# Altium schematic sheet WEB_SERVER.SchDoc: *MC100VER9(webserver)
size A2; Revision: 1
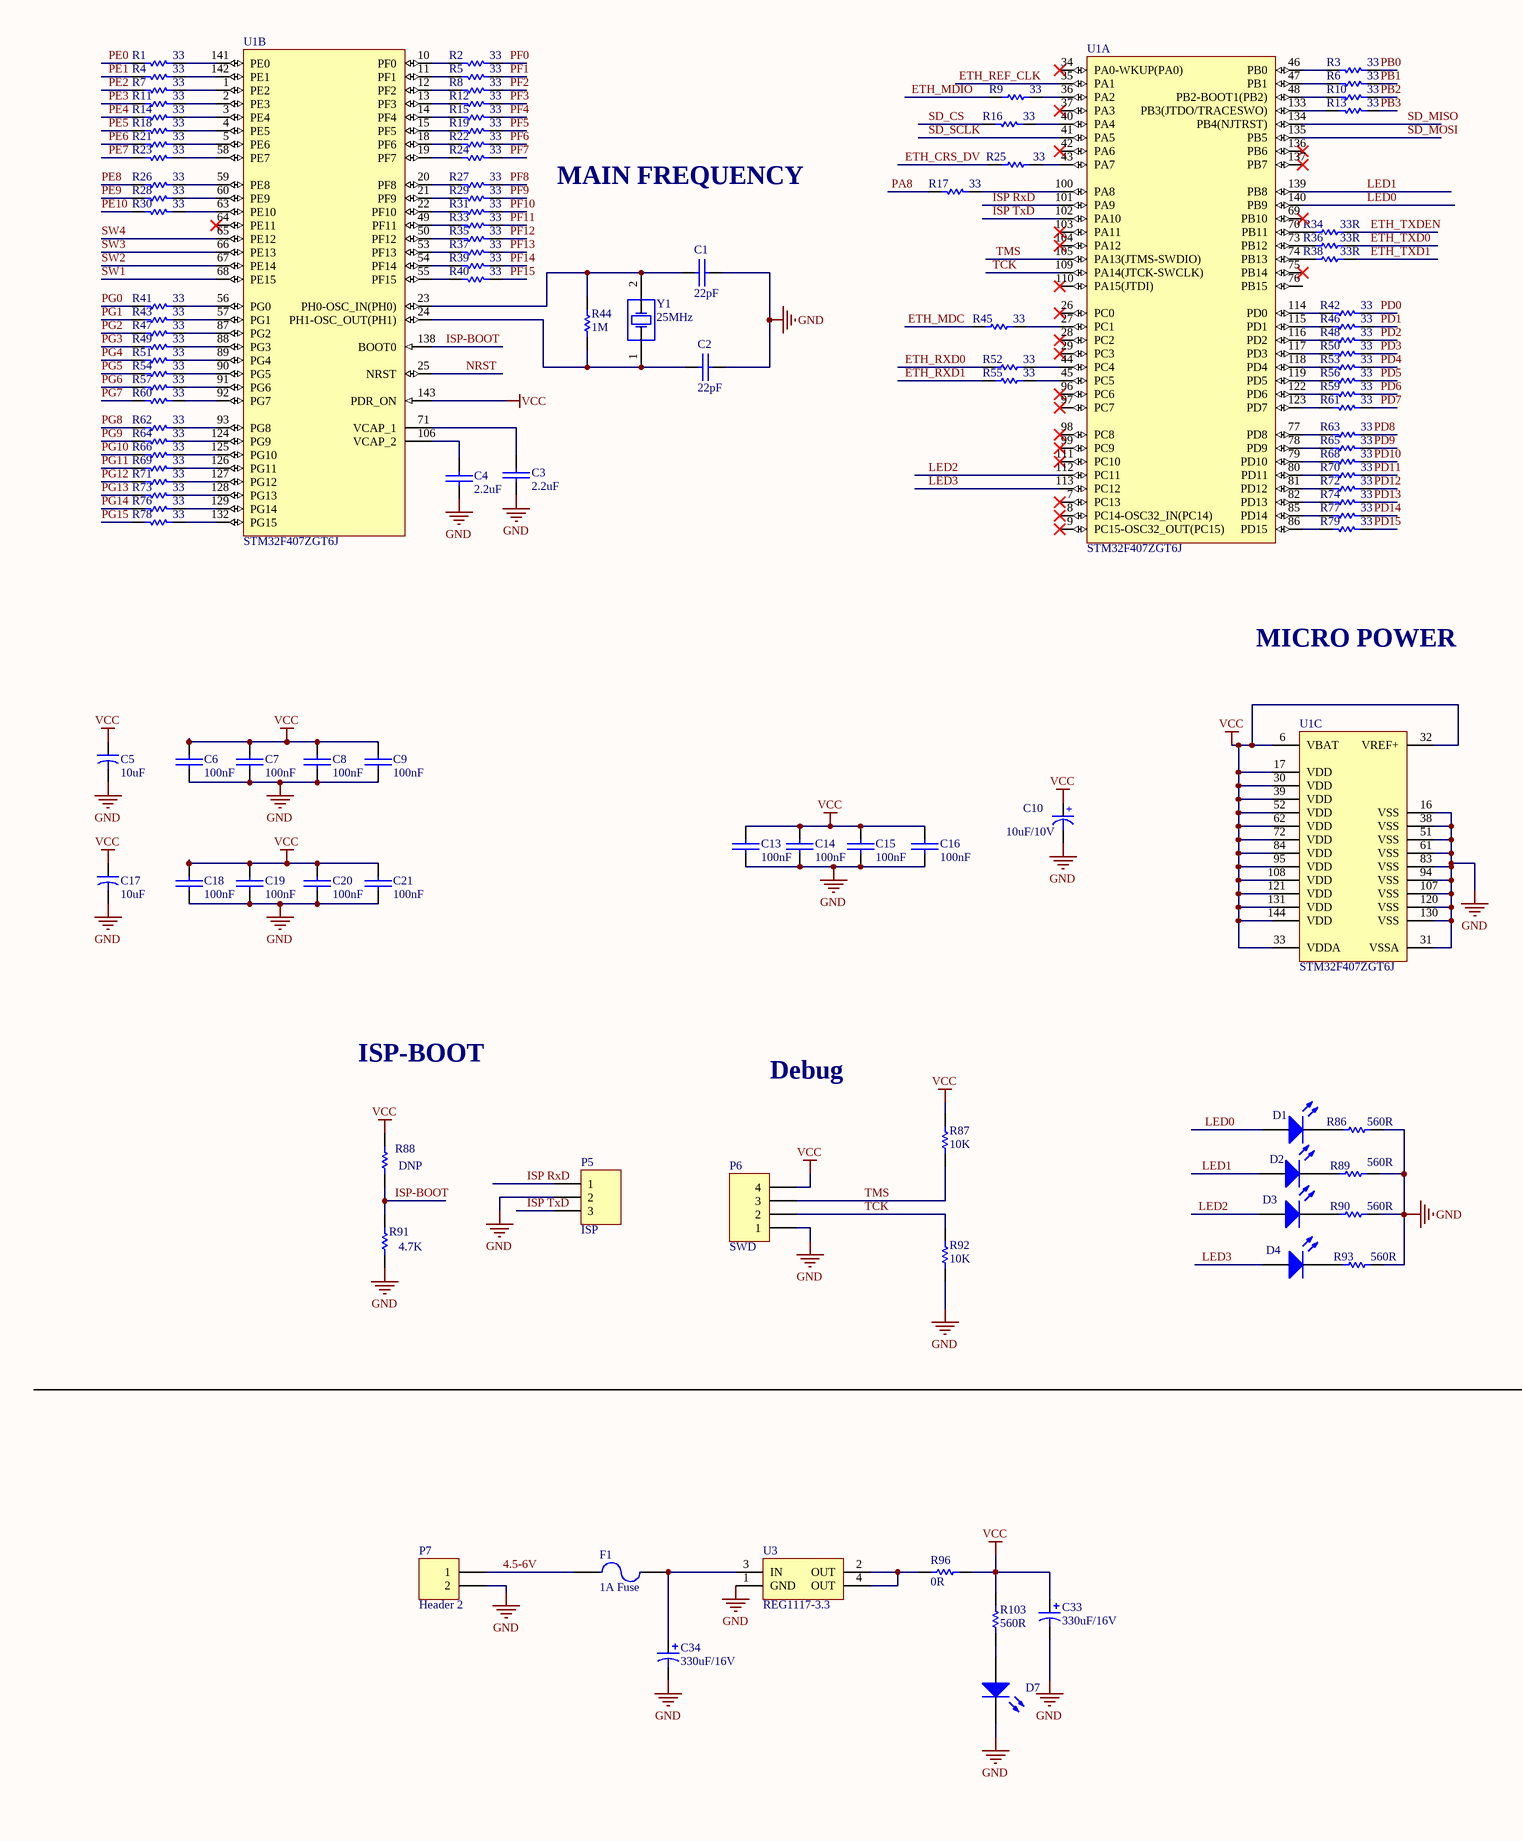
[diagram p0: WEB_SERVER.SchDoc, left]
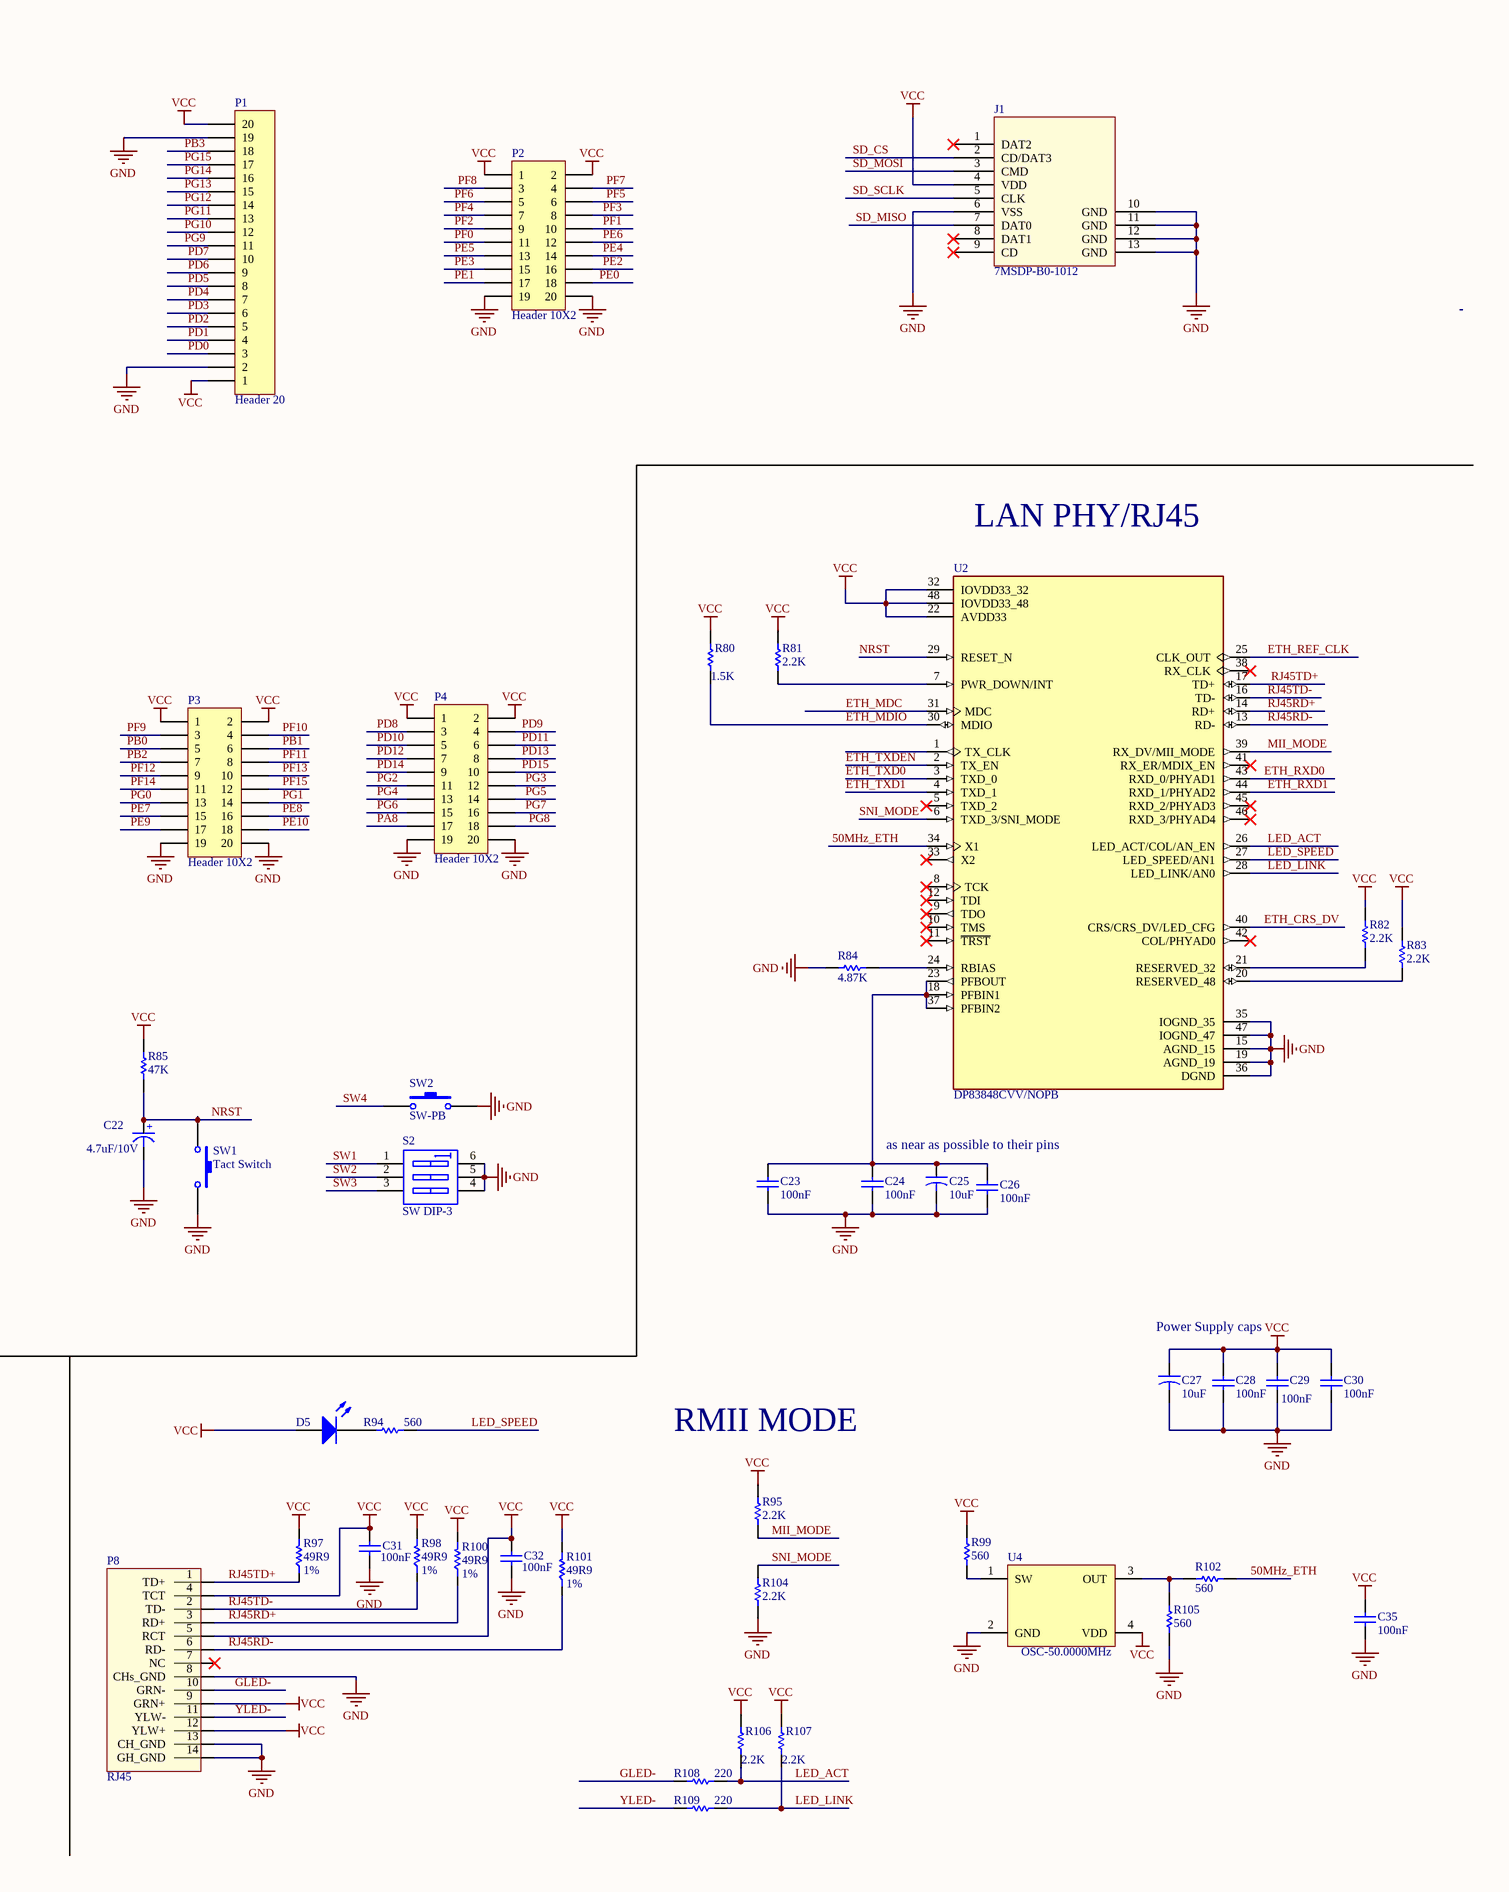
[diagram p1: WEB_SERVER.SchDoc, right]

## Parts
C1  22pF  [C0805]
C2  22pF  [C0805]
C3  2.2uF  [C0805]
C4  2.2uF  [C0805]
C5  10uF  [CAP_Tantal_1206]
C6  100nF  [C0805]
C7  100nF  [C0805]
C8  100nF  [C0805]
C9  100nF  [C0805]
C10  10uF/10V  [CAP_Tantal_1206]
C13  100nF  [C0805]
C14  100nF  [C0805]
C15  100nF  [C0805]
C16  100nF  [C0805]
C17  10uF  [CAP_Tantal_1206]
C18  100nF  [C0805]
C19  100nF  [C0805]
C20  100nF  [C0805]
C21  100nF  [C0805]
C22  4.7uF/10V  [Tantalium CAPP Size A 1206 (3216X18L)]
C23  100nF  [c0805]
C24  100nF  [c0805]
C25  10uF  [CAP_Tantal_1206]
C26  100nF  [c0805]
C27  10uF  [CAP_Tantal_1206]
C28  100nF  [c0805]
C29  100nF  [c0805]
C30  100nF  [c0805]
C31  100nF  [c0805]
C32  100nF  [c0805]
C33  330uF/16V  [RB.15/.3]
C34  330uF/16V  [RB.15/.3]
C35  100nF  [c0805]
D1  LED1  [LED_805]  (value not drawn)
D2  LED1  [LED_805]  (value not drawn)
D3  LED2  [LED_805]  (value not drawn)
D4  LED3  [LED_805]  (value not drawn)
D5  SPEED(G)  [LED0805]  (value not drawn)
D7  LED G  [LED_805]  (value not drawn)
F1  1A Fuse  [6-0805_L]
J1  7MSDP-B0-1012  [MicroSD Slot]
P1  Header 20  [HDR1X20]
P2  Header 10X2  [HDR2X10]
P3  Header 10X2  [HDR2X10]
P4  Header 10X2  [HDR2X10]
P5  ISP  [HDR1X3]
P6  SWD  [HDR1X4]
P7  Header 2  [HDR1X2]
P8  RJ45  [RJ245]
R1  33  [6-0805_L]
R2  33  [6-0805_L]
R3  33  [6-0805_L]
R4  33  [6-0805_L]
R5  33  [6-0805_L]
R6  33  [6-0805_L]
R7  33  [6-0805_L]
R8  33  [6-0805_L]
R9  33  [c0805]
R10  33  [6-0805_L]
R11  33  [6-0805_L]
R12  33  [6-0805_L]
R13  33  [6-0805_L]
R14  33  [6-0805_L]
R15  33  [6-0805_L]
R16  33  [6-0805_L]
R17  33  [6-0805_L]
R18  33  [6-0805_L]
R19  33  [6-0805_L]
R21  33  [6-0805_L]
R22  33  [6-0805_L]
R23  33  [6-0805_L]
R24  33  [6-0805_L]
R25  33  [c0805]
R26  33  [6-0805_L]
R27  33  [6-0805_L]
R28  33  [6-0805_L]
R29  33  [6-0805_L]
R30  33  [6-0805_L]
R31  33  [6-0805_L]
R33  33  [6-0805_L]
R34  33R  [6-0805_L]
R35  33  [6-0805_L]
R36  33R  [6-0805_L]
R37  33  [6-0805_L]
R38  33R  [6-0805_L]
R39  33  [6-0805_L]
R40  33  [6-0805_L]
R41  33  [6-0805_L]
R42  33  [6-0805_L]
R43  33  [6-0805_L]
R44  1M  [c0805]
R45  33  [c0805]
R46  33  [6-0805_L]
R47  33  [6-0805_L]
R48  33  [6-0805_L]
R49  33  [6-0805_L]
R50  33  [6-0805_L]
R51  33  [6-0805_L]
R52  33  [c0805]
R53  33  [6-0805_L]
R54  33  [6-0805_L]
R55  33  [c0805]
R56  33  [6-0805_L]
R57  33  [6-0805_L]
R59  33  [6-0805_L]
R60  33  [6-0805_L]
R61  33  [6-0805_L]
R62  33  [6-0805_L]
R63  33  [6-0805_L]
R64  33  [6-0805_L]
R65  33  [6-0805_L]
R66  33  [6-0805_L]
R68  33  [6-0805_L]
R69  33  [6-0805_L]
R70  33  [6-0805_L]
R71  33  [6-0805_L]
R72  33  [6-0805_L]
R73  33  [6-0805_L]
R74  33  [6-0805_L]
R76  33  [6-0805_L]
R77  33  [6-0805_L]
R78  33  [6-0805_L]
R79  33  [6-0805_L]
R80  1.5K  [c0805]
R81  2.2K  [c0805]
R82  2.2K  [c0805]
R83  2.2K  [c0805]
R84  4.87K  [c0805]
R85  47K  [6-0805_L]
R86  560R  [6-0805_L]
R87  10K  [6-0805_L]
R88  DNP  [6-0805_L]
R89  560R  [6-0805_L]
R90  560R  [6-0805_L]
R91  4.7K  [6-0805_L]
R92  10K  [6-0805_L]
R93  560R  [6-0805_L]
R94  560  [c0805]
R95  2.2K  [c0805]
R96  0R  [6-0805_L]
R97  Tolerance: 1%  [c0805]  (hidden comment: 49R9)
R98  Tolerance: 1%  [c0805]  (hidden comment: 49R9)
R99  560  [c0805]
R100  Tolerance: 1%  [c0805]  (hidden comment: 49R9)
R101  Tolerance: 1%  [c0805]  (hidden comment: 49R9)
R102  560  [c0805]
R103  560R  [6-0805_L]
R104  2.2K  [c0805]
R105  560  [c0805]
R106  2.2K  [c0805]
R107  2.2K  [c0805]
R108  220  [c0805]
R109  220  [c0805]
S2  SW DIP-3  [DIP-6]
SW1  Tact Switch  [TUCHSWITCH_SMD_2]
SW2  SW-PB  [TUCHSWITCH_SMD_2]
U1  STM32F407ZGT6J  [STM-LQFP144_N]  (parts A,B,C of 3)
U2  DP83848CVV/NOPB  [QFP50P900X900X160-49N]
U3  REG1117-3.3  [ZZ311]
U4  OSC-50.0000MHz  [XTAL-5*7]
Y1  25MHz  [XTAL - smd (2 Pad Crystal Oscilator)]

## Nets
GND: C1.2(-) C2.1(+) C3.1(+) C4.1(+) C5.2 C6.2(-) C7.2(-) C8.2(-) C9.2(-) C10.2(-) C13.2(-) C14.2(-) C15.2(-) C16.2(-) C17.2 C18.2(-) C19.2(-) C20.2(-) C21.2(-) C22.2(-) C23.2 C24.2 C25.2 C26.2 C27.2 C28.2 C29.2 C30.2 C31.2 C32.2 C33.2 C34.2 C35.2 D7.2(K) J1.6(VSS) J1.10(GND) J1.11(GND) J1.12(GND) J1.13(GND) P1.2 P1.19 P2.19 P2.20 P3.19 P3.20 P4.19 P4.20 P5.2 P6.1 P7.2 P8.8(CHs_GND) P8.13(CH_GND) P8.14(GH_GND) R84.2 R86.1 R89.2 R90.2 R91.1 R92.2 R93.2 R104.1 R105.2 S2.4(B3) S2.5(B2) S2.6(B1) SW1.2 SW2.2 U1.16(VSS) U1.31(VSSA) U1.38(VSS) U1.51(VSS) U1.61(VSS) U1.83(VSS) U1.94(VSS) U1.107(VSS) U1.120(VSS) U1.130(VSS) U2.15(AGND_15) U2.19(AGND_19) U2.35(IOGND_35) U2.36(DGND) U2.47(IOGND_47) U3.1(GND) U4.2(GND)
VCC: C5.1 C6.1(+) C7.1(+) C8.1(+) C9.1(+) C10.1(+) C13.1(+) C14.1(+) C15.1(+) C16.1(+) C17.1 C18.1(+) C19.1(+) C20.1(+) C21.1(+) C27.1 C28.1 C29.1 C30.1 C31.1 C32.1 C33.1 C35.1 D5.1(A) J1.4(VDD) P1.1 P1.20 P2.1 P2.2 P3.1 P3.2 P4.1 P4.2 P6.4 P8.4(TCT) P8.5(RCT) P8.9(GRN+) P8.12(YLW+) R80.2 R81.2 R82.2 R83.2 R85.2 R87.2 R88.2 R95.2 R96.1 R97.2 R98.2 R99.2 R100.2 R101.2 R103.2 R106.2 R107.2 U1.6(VBAT) U1.17(VDD) U1.30(VDD) U1.32(VREF+) U1.33(VDDA) U1.39(VDD) U1.52(VDD) U1.62(VDD) U1.72(VDD) U1.84(VDD) U1.95(VDD) U1.108(VDD) U1.121(VDD) U1.131(VDD) U1.143(PDR_ON) U1.144(VDD) U2.22(AVDD33) U2.32(IOVDD33_32) U2.48(IOVDD33_48) U4.4(VDD)
4.5-6V: F1.1 P7.1
50MHz_ETH: R102.1 U2.34(X1)
ETH_CRS_DV: R25.1 U2.40(CRS/CRS_DV/LED_CFG)
ETH_MDC: R45.2 U2.31(MDC)
ETH_MDIO: R9.2 R80.1 U2.30(MDIO)
ETH_REF_CLK: U1.35(PA1) U2.25(CLK_OUT)
ETH_RXD0: R52.2 U2.43(RXD_0/PHYAD1)
ETH_RXD1: R55.2 U2.44(RXD_1/PHYAD2)
ETH_TXD0: R36.2 U2.3(TXD_0)
ETH_TXD1: R38.2 U2.4(TXD_1)
ETH_TXDEN: R34.2 U2.2(TX_EN)
GLED-: P8.10(GRN-) R108.1
ISP RxD: P5.1 U1.101(PA9)
ISP TxD: P5.3 U1.102(PA10)
ISP-BOOT: R88.1 R91.2 U1.138(BOOT0)
LED0: D1.1(A) U1.140(PB9)
LED1: D2.1(A) U1.139(PB8)
LED2: D3.1(A) U1.112(PC11)
LED3: D4.1(A) U1.113(PC12)
LED_ACT: R106.1 R108.2 U2.26(LED_ACT/COL/AN_EN)
LED_LINK: R107.1 R109.2 U2.28(LED_LINK/AN0)
LED_SPEED: R94.2 U2.27(LED_SPEED/AN1)
MII_MODE: R95.1 U2.39(RX_DV/MII_MODE)
NRST: C22.1(+) R85.1 SW1.1 U1.25(NRST) U2.29(RESET_N)
PA8: P4.17 R17.1
PB0: P3.5 R3.2
PB1: P3.6 R6.2
PB2: P3.7 R10.2
PB3: P1.18 R13.2
PD0: P1.3 R42.2
PD1: P1.4 R46.2
PD2: P1.5 R48.2
PD3: P1.6 R50.2
PD4: P1.7 R53.2
PD5: P1.8 R56.2
PD6: P1.9 R59.2
PD7: P1.10 R61.2
PD8: P4.3 R63.2
PD9: P4.4 R65.2
PD10: P4.5 R68.2
PD11: P4.6 R70.2
PD12: P4.7 R72.2
PD13: P4.8 R74.2
PD14: P4.9 R77.2
PD15: P4.10 R79.2
PE0: P2.18 R1.1
PE1: P2.17 R4.1
PE2: P2.16 R7.1
PE3: P2.15 R11.1
PE4: P2.14 R14.1
PE5: P2.13 R18.1
PE6: P2.12 R21.1
PE7: P3.15 R23.1
PE8: P3.16 R26.1
PE9: P3.17 R28.1
PE10: P3.18 R30.1
PF0: P2.11 R2.2
PF1: P2.10 R5.2
PF2: P2.9 R8.2
PF3: P2.8 R12.2
PF4: P2.7 R15.2
PF5: P2.6 R19.2
PF6: P2.5 R22.2
PF7: P2.4 R24.2
PF8: P2.3 R27.2
PF9: P3.3 R29.2
PF10: P3.4 R31.2
PF11: P3.8 R33.2
PF12: P3.9 R35.2
PF13: P3.10 R37.2
PF14: P3.11 R39.2
PF15: P3.12 R40.2
PG0: P3.13 R41.1
PG1: P3.14 R43.1
PG2: P4.11 R47.1
PG3: P4.12 R49.1
PG4: P4.13 R51.1
PG5: P4.14 R54.1
PG6: P4.15 R57.1
PG7: P4.16 R60.1
PG8: P4.18 R62.1
PG9: P1.11 R64.1
PG10: P1.12 R66.1
PG11: P1.13 R69.1
PG12: P1.14 R71.1
PG13: P1.15 R73.1
PG14: P1.16 R76.1
PG15: P1.17 R78.1
RJ45RD+: P8.3(RD+) R100.1 U2.14(RD+)
RJ45RD-: P8.6(RD-) R101.1 U2.13(RD-)
RJ45TD+: P8.1(TD+) R97.1 U2.17(TD+)
RJ45TD-: P8.2(TD-) R98.1 U2.16(TD-)
SD_CS: J1.2(CD/DAT3) R16.1
SD_MISO: J1.7(DAT0) U1.134(PB4(NJTRST))
SD_MOSI: J1.3(CMD) U1.135(PB5)
SD_SCLK: J1.5(CLK) U1.41(PA5)
SNI_MODE: R104.2 U2.6(TXD_3/SNI_MODE)
SW1: S2.1(A1) U1.68(PE15)
SW2: S2.2(A2) U1.67(PE14)
SW3: S2.3(A3) U1.66(PE13)
SW4: SW2.1 U1.65(PE12)
TCK: P6.2 R92.1 U1.109(PA14(JTCK-SWCLK))
TMS: P6.3 R87.1 U1.105(PA13(JTMS-SWDIO))
YLED-: P8.11(YLW-) R109.1
NetC1_1: C1.1(+) R44.2 U1.23(PH0-OSC_IN(PH0)) Y1.2(OSC2)
NetC2_2: C2.2(-) R44.1 U1.24(PH1-OSC_OUT(PH1)) Y1.1(OSC1)
NetC3_2: C3.2(-) U1.71(VCAP_1)
NetC4_2: C4.2(-) U1.106(VCAP_2)
NetC23_1: C23.1 C24.1 C25.1 C26.1 U2.18(PFBIN1) U2.23(PFBOUT) U2.37(PFBIN2)
NetC34_1: C34.1 F1.2 U3.3(IN)
NetD1_2: D1.2(K) R86.2
NetD2_2: D2.2(K) R89.1
NetD3_2: D3.2(K) R90.1
NetD4_2: D4.2(K) R93.1
NetD5_2: D5.2(K) R94.1
NetD7_1: D7.1(A) R103.1
NetR1_2: R1.2 U1.141(PE0)
NetR2_1: R2.1 U1.10(PF0)
NetR3_1: R3.1 U1.46(PB0)
NetR4_2: R4.2 U1.142(PE1)
NetR5_1: R5.1 U1.11(PF1)
NetR6_1: R6.1 U1.47(PB1)
NetR7_2: R7.2 U1.1(PE2)
NetR8_1: R8.1 U1.12(PF2)
NetR9_1: R9.1 U1.36(PA2)
NetR10_1: R10.1 U1.48(PB2-BOOT1(PB2))
NetR11_2: R11.2 U1.2(PE3)
NetR12_1: R12.1 U1.13(PF3)
NetR13_1: R13.1 U1.133(PB3(JTDO/TRACESWO))
NetR14_2: R14.2 U1.3(PE4)
NetR15_1: R15.1 U1.14(PF4)
NetR16_2: R16.2 U1.40(PA4)
NetR17_2: R17.2 U1.100(PA8)
NetR18_2: R18.2 U1.4(PE5)
NetR19_1: R19.1 U1.15(PF5)
NetR21_2: R21.2 U1.5(PE6)
NetR22_1: R22.1 U1.18(PF6)
NetR23_2: R23.2 U1.58(PE7)
NetR24_1: R24.1 U1.19(PF7)
NetR25_2: R25.2 U1.43(PA7)
NetR26_2: R26.2 U1.59(PE8)
NetR27_1: R27.1 U1.20(PF8)
NetR28_2: R28.2 U1.60(PE9)
NetR29_1: R29.1 U1.21(PF9)
NetR30_2: R30.2 U1.63(PE10)
NetR31_1: R31.1 U1.22(PF10)
NetR33_1: R33.1 U1.49(PF11)
NetR34_1: R34.1 U1.70(PB11)
NetR35_1: R35.1 U1.50(PF12)
NetR36_1: R36.1 U1.73(PB12)
NetR37_1: R37.1 U1.53(PF13)
NetR38_1: R38.1 U1.74(PB13)
NetR39_1: R39.1 U1.54(PF14)
NetR40_1: R40.1 U1.55(PF15)
NetR41_2: R41.2 U1.56(PG0)
NetR42_1: R42.1 U1.114(PD0)
NetR43_2: R43.2 U1.57(PG1)
NetR45_1: R45.1 U1.27(PC1)
NetR46_1: R46.1 U1.115(PD1)
NetR47_2: R47.2 U1.87(PG2)
NetR48_1: R48.1 U1.116(PD2)
NetR49_2: R49.2 U1.88(PG3)
NetR50_1: R50.1 U1.117(PD3)
NetR51_2: R51.2 U1.89(PG4)
NetR52_1: R52.1 U1.44(PC4)
NetR53_1: R53.1 U1.118(PD4)
NetR54_2: R54.2 U1.90(PG5)
NetR55_1: R55.1 U1.45(PC5)
NetR56_1: R56.1 U1.119(PD5)
NetR57_2: R57.2 U1.91(PG6)
NetR59_1: R59.1 U1.122(PD6)
NetR60_2: R60.2 U1.92(PG7)
NetR61_1: R61.1 U1.123(PD7)
NetR62_2: R62.2 U1.93(PG8)
NetR63_1: R63.1 U1.77(PD8)
NetR64_2: R64.2 U1.124(PG9)
NetR65_1: R65.1 U1.78(PD9)
NetR66_2: R66.2 U1.125(PG10)
NetR68_1: R68.1 U1.79(PD10)
NetR69_2: R69.2 U1.126(PG11)
NetR70_1: R70.1 U1.80(PD11)
NetR71_2: R71.2 U1.127(PG12)
NetR72_1: R72.1 U1.81(PD12)
NetR73_2: R73.2 U1.128(PG13)
NetR74_1: R74.1 U1.82(PD13)
NetR76_2: R76.2 U1.129(PG14)
NetR77_1: R77.1 U1.85(PD14)
NetR78_2: R78.2 U1.132(PG15)
NetR79_1: R79.1 U1.86(PD15)
NetR81_1: R81.1 U2.7(PWR_DOWN/INT)
NetR82_1: R82.1 U2.21(RESERVED_32)
NetR83_1: R83.1 U2.20(RESERVED_48)
NetR84_1: R84.1 U2.24(RBIAS)
NetR96_2: R96.2 U3.2(OUT) U3.4(OUT)
NetR99_1: R99.1 U4.1(SW)
NetR102_2: R102.2 R105.1 U4.3(OUT)

Not connected (* = marked no-connect by the designer): J1 1(DAT2)* 8(DAT1)* 9(CD)*; P8 7(NC)*; U1 7(PC13)* 8(PC14-OSC32_IN(PC14))* 9(PC15-OSC32_OUT(PC15))* 26(PC0)* 28(PC2)* 29(PC3)* 34(PA0-WKUP(PA0))* 37(PA3)* 42(PA6)* 64(PE11)* 69(PB10)* 75(PB14)* 76(PB15) 96(PC6)* 97(PC7)* 98(PC8)* 99(PC9)* 103(PA11)* 104(PA12)* 110(PA15(JTDI))* 111(PC10)* 136(PB6)* 137(PB7)*; U2 1(TX_CLK) 5(TXD_2)* 8(TCK)* 9(TDO)* 10(TMS)* 11(~{TRST})* 12(TDI)* 33(X2)* 38(RX_CLK)* 41(RX_ER/MDIX_EN)* 42(COL/PHYAD0)* 45(RXD_2/PHYAD3)* 46(RXD_3/PHYAD4)*

## Notes on the sheet
- MAIN FREQUENCY
- LAN PHY/RJ45
- MICRO POWER
- ISP-BOOT
- Debug
- as near as possible to their pins
- Power Supply caps
- RMII MODE

## Library data of the parts
C1-C4 = Cap-Bipolar: Bipolar Capacitor; Voltage: 100V; Designer: Saeid Jorablo; Organazation: ControTec; Adding Date: 1387/12/20
  C1 C2: Value: 22pF
  C3 C4: Value: 2.2uF
C5 C17 C25 C27 = Cap2: Capacitor Tantal; Value: 100pF; Published: 23-Sep-2002; PackageReference: CAPR5-4X5; Publisher: Altium Limited; PackageDescription: Capacitor; 2 Leads
C6-C9 C13-C16 C18-C21 = Cap-Bipolar: ceramic Capacitor; Voltage: 100V; Designer: Saeid Jorablo; Organazation: ControTec; Adding Date: 1387/12/20; Value: 100nF
C10 C22 = Cap-Polar: Polar Capacitor; Designer: Saeid Jorablo; Organazation: ControTec; Voltage: 10V 3216; Adding Date: 1387/12/20
  C10: Value: 10uF/10V
  C22: Value: 4.7uF/10V
C23 C24 C26 C28-C32 C35 = Cap: Capacitor; Value: 100pF; Published: 8-Jun-2000; LatestRevisionDate: 17-Jul-2002; LatestRevisionNote: Re-released for DXP Platform.; PackageReference: RAD-0.3; Publisher: Altium Limited; PackageDescription: Radial Cap, Thru-Hole; 2 Leads; 0.3 in Pin Spacing
C33 C34 = Cap Pol1: Polarized Capacitor (Radial); Published: 8-Jun-2000; LatestRevisionDate: 17-Jul-2002; LatestRevisionNote: Re-released for DXP Platform.; PackageReference: RB7.6-15; Publisher: Altium Limited; Value: 330uF/16V
D1-D5 D7 = LED3: Typical BLUE SiC LED; Published: 8-Jun-2000; LatestRevisionDate: 17-Dec-2003; LatestRevisionNote: PCB Footprint replaced.; PackageReference: 3.5X2.8X1.9; Publisher: Altium Limited
  D1-D4 D7: DatasheetDocument: 16-Apr-2002; PackageDocument: 16-Apr-2002
  D5: DatasheetVersion: 16-Apr-2002; PackageVersion: 16-Apr-2002; PackageDescription: SM LED; 2 C-Bend Leads; Body 3.5 x 2.8 x 1.9 mm, inc leads (LxWxH typ)
F1 = Fuse 2: Fuse; Published: 8-Jun-2000; LatestRevisionDate: 17-Jul-2002; LatestRevisionNote: Re-released for DXP Platform.; PackageReference: PIN-W2/E2.8; Publisher: Altium Limited
J1 = 7MSDP-B0-1012: MicroSD Slot
P1 = Header 20: Header, 20-Pin; LatestRevisionDate: 17-Jul-2002; LatestRevisionNote: Re-released for DXP Platform.; Publisher: Altium Limited
P2-P4 = Header 10X2: Header, 10-Pin, Dual row; LatestRevisionDate: 17-Jul-2002; LatestRevisionNote: Re-released for DXP Platform.; Publisher: Altium Limited
P5 = Header 3: Header, 3-Pin; LatestRevisionDate: 17-Jul-2002; LatestRevisionNote: Re-released for DXP Platform.; Publisher: Altium Limited
P6 = Header 4: Header, 4-Pin; LatestRevisionDate: 17-Jul-2002; LatestRevisionNote: Re-released for DXP Platform.; Publisher: Altium Limited
P7 = Header 2: Header, 2-Pin; LatestRevisionDate: 17-Jul-2002; LatestRevisionNote: Re-released for DXP Platform.; Publisher: Altium Limited
P8 = RJ245
R1-R8 R10-R19 R21-R24 R26-R31 R33 R35 R37 R39-R43 R46-R51 R53 R54 R56 R57 R59-R66 R68-R74 R76-R79 R88 R91 = Res Semi: Semiconductor Resistor; Value: 1K; Published: 8-Jun-2000; LatestRevisionDate: 17-Jul-2002; LatestRevisionNote: Re-released for DXP Platform.; PackageReference: AXIAL-0.5; Publisher: Altium Limited; PackageDescription: Axial Device, Thru-Hole; 2 Leads; 0.5 in Pin Spacing
R9 R25 R44 R45 R52 R55 R80 R106-R109 = Res1: Resistor; Value: 1K; Published: 8-Jun-2000; LatestRevisionDate: 17-Jul-2002; LatestRevisionNote: Re-released for DXP Platform.; PackageReference: AXIAL-0.3; Publisher: Altium Limited; PackageDescription: Axial Device, Thru-Hole; 2 Leads; 0.3 in Pin Spacing
R34 R36 R38 R85-R87 R92 R94 R96 R99 R102 R103 R105 = Res Semi: Semiconductor Resistor; Published: 8-Jun-2000; LatestRevisionDate: 17-Jul-2002; LatestRevisionNote: Re-released for DXP Platform.; PackageReference: AXIAL-0.5; Publisher: Altium Limited
  R34 R36 R38: Value: 33R
  R85: Value: 47K
  R86 R103: Value: 560R
  R87 R92: Value: 10K
  R94 R99 R102 R105: Value: 560; PackageDescription: Axial Device, Thru-Hole; 2 Leads; 0.5 in Pin Spacing
  R96: Value: 0R
R81-R83 R89 R90 R93 R95 R104 = Res Semi: Semiconductor Resistor; Value: 560; Published: 8-Jun-2000; LatestRevisionDate: 17-Jul-2002; LatestRevisionNote: Re-released for DXP Platform.; PackageReference: AXIAL-0.5; Publisher: Altium Limited
  R81-R83 R95 R104: PackageDescription: Axial Device, Thru-Hole; 2 Leads; 0.5 in Pin Spacing
R84 = Res1: Resistor 1%; Value: 1K; Published: 8-Jun-2000; LatestRevisionDate: 17-Jul-2002; LatestRevisionNote: Re-released for DXP Platform.; PackageReference: AXIAL-0.3; Publisher: Altium Limited; PackageDescription: Axial Device, Thru-Hole; 2 Leads; 0.3 in Pin Spacing
R97 R98 R100 R101 = Resistor: Power: 1/8 W; Value: 49R9
S2 = SW DIP-3: DIP Switch, 3 Position, SPST; Published: 24-Mar-1999; LatestRevisionDate: 17-Jul-2002; LatestRevisionNote: Re-released for DXP Platform.; PackageReference: DIP-6; Publisher: Altium Limited; Code_JEDEC: MO-001-AM
SW1 = Tak Switch: Swich; Designer: ziatbt@gmail.com; Designed: 19-October-2009
SW2 = SW-PB: Switch; Published: 24-Mar-1999; LatestRevisionDate: 17-Jul-2002; LatestRevisionNote: Re-released for DXP Platform.; PackageReference: SPST-2; Publisher: Altium Limited; PackageDescription: Switch; 2 Leads
U1 = STM32F407ZGT6J: ARM Cortex-M4 32-bit MCU+FPU, 210 DMIPS, 1024 kB Flash, 192 kB Internal RAM, 114 I/Os, 144-pin LQFP, -40 to 85 degC, Tray; Manufacturer: STMicroelectronics; D/A Converter: 2x12-bit; FLASH Size (Prog) (kB): 1024; I/Os (High Current): 114; Internal RAM Size (kB): 192; Operating Frequency(F) (Processor speed) (MHz): 168; Supply Voltage(Vcc) max (V): 3.6; Supply Voltage(Vcc) min (V): 1.8; DatasheetVersion: Rev. 4; PackageVersion: Rev. 4, 06/2013; PackageReference: LQFP144; PackageDescription: 144-Pin Low Profile Quad Flat Package, 20 x 20 mm Body, 0.5 mm Pitch; Supplier 1: Digi-Key; Supplier Part Number 1: STM32F407ZGT6J-ND; Supplier 2: Farnell; Supplier Part Number 2: 2333299; Supplier 3: Newark; Supplier Part Number 3: 99W9915; Supplier 4: Newark; Supplier Part Number 4: 66W7308; Supplier 5: Mouser; Supplier Part Number 5: 511-STM32F407ZGT6J; Core: ARM Cortex-M4; Packing: Tray; Mounting Technology: Surface Mount; PartNumber: STM32F407ZGT6J; ComponentLink1Description: Manufacturer URL; ComponentLink1URL: http://www.st.com/web/en/home.html; ComponentLink2Description: Datasheet; ComponentLink2URL: http://www.st.com/st-web-ui/static/active/en/resource/technical/document/datasheet/DM00037051.pdf; ComponentLink3Description: Package Specification; ComponentLink3URL: http://www.st.com/st-web-ui/static/active/en/resource/technical/document/datasheet/DM00037051.pdf
U3 = REG1117-3.3: 800mA and 1A Low Dropout Positive Regulator 2.85V, 3.3V, 5V, and Adjustable; Published: 8-Jun-2000; LatestRevisionDate: 17-Jul-2002; LatestRevisionNote: Re-released for DXP Platform.; DatasheetVersion: Sep-1997; PackageVersion: revC; PackageReference: ZZ311; Publisher: Altium Limited; PackageDescription: SOT-223/SC-73; 4 Leads; Body 6.7 x 7.3 mm, inc. leads (LxW max); ComponentLink1Description: Manufacturer Link; ComponentLink1URL: http://www.ti.com/; ComponentLink2Description: Datasheet; ComponentLink2URL: http://www-s.ti.com/sc/ds/REG1117.pdf
U4 = XTALL-24.0000
Y1 = XTAL: Crystal Oscillator; Published: 8-Jun-2000; LatestRevisionDate: 17-Jul-2002; LatestRevisionNote: Re-released for DXP Platform.; PackageReference: R38; Publisher: Altium Limited; PackageDescription: Crystal, Thru-Hole; 2 Leads; Body 3.1 x 8.2 mm (Dia.xH)
U2 = DP83848CVV/NOPB: Price: None; Value: *; MP: DP83848CVV/NOPB; Package: None; Availability: Unavailable